# Altium schematic sheet Schematic_Thu.SchDoc
size A
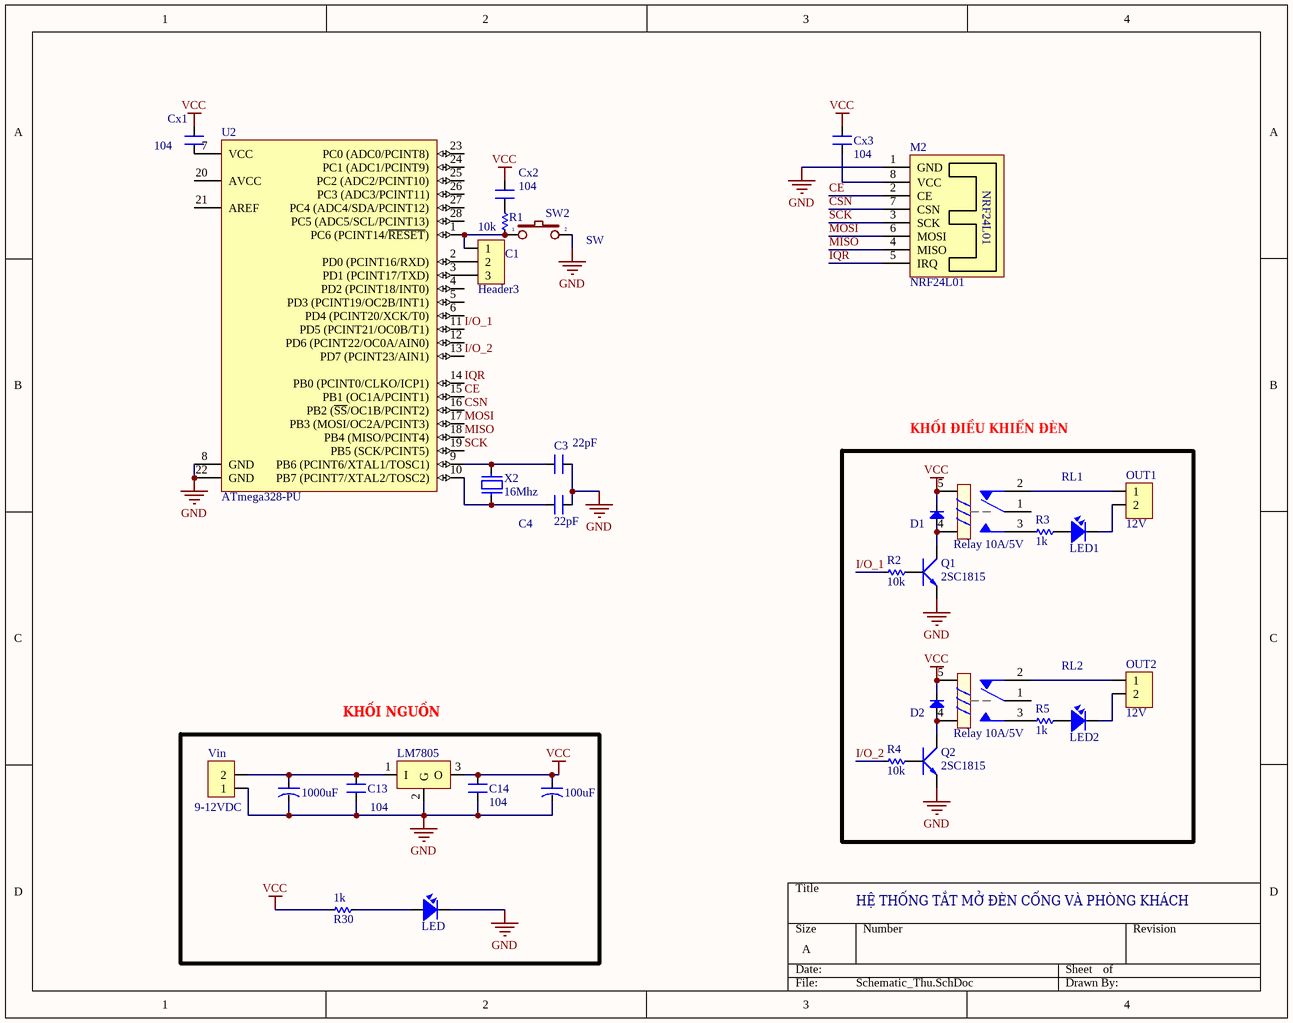
[diagram p0: Schematic_Thu.SchDoc]

## Parts
1k  R30  [RES-1/2W]
100uF  CN-ALU-DIP  [CA-ALU-2.54]  (value not drawn)
1000uF  CN-ALU-DIP  [CA-ALU-2.54]  (value not drawn)
C1  Header3  [HDR3]
C3  22pF  [CN1.5]
C4  22pF  [CN1.5]
C13  104  [CN1.5]
C14  104  [CN1.5]
Cx1  104  [CN-SMD-0805]
Cx2  104  [CN-SMD-0805]
Cx3  104  [CN-SMD-0805]
D1  Diode  [DIO-1A]  (value not drawn)
D2  Diode  [DIO-1A]  (value not drawn)
LED  LED  [LED-3MM-RED]  (value not drawn)
LED1  LED  [LED 3512]  (value not drawn)
LED2  LED  [LED 3512]  (value not drawn)
LM7805  LM78xx  [TO220-123]  (value not drawn)
M2  NRF24L01  [NRF24L01]
OUT1  12V  [Header2]
OUT2  12V  [Header2]
Q1  2SC1815  [TO92-123]
Q2  2SC1815  [TO92-123]
R1  10k  [RES-1/2W]
R2  10k  [RES-1/2W]
R3  1k  [RES-1/2W]
R4  10k  [RES-1/2W]
R5  1k  [RES-1/2W]
RL1  Relay 10A/5V  [RELAY 5]
RL2  Relay 10A/5V  [RELAY 5]
SW2  SW  [SW1-DIP]
U2  ATmega328-PU  [DIP28]
Vin  9-12VDC  [Header2]
X2  16Mhz  [XT2]

## Blocks framed on the sheet
KHỐI ĐIỀU KHIỂN ĐÈN: D1 D2 LED1 LED2 OUT1 OUT2 Q1 Q2 R2-R5 RL1 RL2
KHỐI NGUỒN: 1k 100uF 1000uF C13 C14 LED LM7805 Vin

## Nets
GND: 100uF.2 1000uF.2 C3.2 C4.2 C13.2 C14.1 LED.2 LM7805.2(G) M2.1(GND) Q1.1(E) Q2.1(E) SW2.2 U2.8(GND) U2.22(GND) Vin.1
VCC: 1k.2 100uF.1 C14.2 Cx1.2 Cx2.2 Cx3.2 D1.2(K) D2.2(K) LM7805.3(O) RL1.5 RL2.5
CE: M2.2(CE) U2.15(PB1_(OC1A/PCINT1))
CSN: M2.7(CSN) U2.16(PB2_(~{SS}/OC1B/PCINT2))
I/O_1: R2.2 U2.11(PD5_(PCINT21/OC0B/T1))
I/O_2: R4.2 U2.13(PD7_(PCINT23/AIN1))
IQR: M2.5(IRQ) U2.14(PB0_(PCINT0/CLKO/ICP1))
MISO: M2.4(MISO) U2.18(PB4_(MISO/PCINT4))
MOSI: M2.6(MOSI) U2.17(PB3_(MOSI/OC2A/PCINT3))
SCK: M2.3(SCK) U2.19(PB5_(SCK/PCINT5))
Net1k_1: 1k.1 LED.1
Net1000uF_1: 1000uF.1 C13.1 LM7805.1(I) Vin.2
NetC1_1: C1.1 R1.1 SW2.1 U2.1(PC6_(PCINT14/~{RESET}))
NetC1_2: C1.2 U2.2(PD0_(PCINT16/RXD))
NetC1_3: C1.3 U2.3(PD1_(PCINT17/TXD))
NetC3_1: C3.1 U2.9(PB6_(PCINT6/XTAL1/TOSC1)) X2.2
NetC4_1: C4.1 U2.10(PB7_(PCINT7/XTAL2/TOSC2)) X2.1
NetCx1_1: Cx1.1 U2.7(VCC)
NetCx2_1: Cx2.1 R1.2
NetCx3_1: Cx3.1 M2.8(VCC)
NetD1_1: D1.1(A) Q1.2(C) RL1.4
NetD2_1: D2.1(A) Q2.2(C) RL2.4
NetLED1_1: LED1.1 R3.2
NetLED1_2: LED1.2 OUT1.2
NetLED2_1: LED2.1 R5.2
NetLED2_2: LED2.2 OUT2.2
NetOUT1_1: OUT1.1 RL1.2
NetOUT2_1: OUT2.1 RL2.2
NetQ1_3: Q1.3(B) R2.1
NetQ2_3: Q2.3(B) R4.1
NetR3_1: R3.1 RL1.3
NetR5_1: R5.1 RL2.3

Not connected (* = marked no-connect by the designer): RL1 1; RL2 1; U2 4(PD2_(PCINT18/INT0)) 5(PD3_(PCINT19/OC2B/INT1)) 6(PD4_(PCINT20/XCK/T0)) 12(PD6_(PCINT22/OC0A/AIN0)) 20(AVCC) 21(AREF) 23(PC0_(ADC0/PCINT8)) 24(PC1_(ADC1/PCINT9)) 25(PC2_(ADC2/PCINT10)) 26(PC3_(ADC3/PCINT11)) 27(PC4_(ADC4/SDA/PCINT12)) 28(PC5_(ADC5/SCL/PCINT13))

## Notes on the sheet
- HỆ THỐNG TẮT MỞ ĐÈN CỔNG VÀ PHÒNG KHÁCH

## Library data of the parts
1k R1-R5 = Res: Manufacturer: Generic Components; Class: Passive; SubClass: R; Published: 08/06/2000; Publisher: Altium Hobart Technology Centre
100uF 1000uF = CN-ALU-DIP: Capacitor (Semiconductor SIM Model); Value: 104; LatestRevisionDate: 17-Jul-2002; LatestRevisionNote: Re-released for DXP Platform.; PackageReference: C1206; Publisher: Altium Limited
C1 = Header3: Header IDC, 3 x 1 Pin Vertical 2.54mm Pitch (Non-Boxed, Male); Manufacturer: W¨¹rth Elektronik eiSos GmbH; partNo: 613002143121; ComponentLink1 Description: Manufacturer; ComponentLink2 Description: Datasheet; NoPins: 02; Created Date: 29 March 2013; ComponentLink1URL: http://www.we-online.com; ComponentLink2URL: http://katalog.we-online.de/em/datasheet/6130xx143121.pdf; Created by: Karrer Zheng
C3 C4 C13 C14 Cx1-Cx3 = CN: Value: 33pF
D1 D2 = Diode: Default Diode; Code - JEDEC: DO-214-AB; Value: 1N5007; Published: 8-Jun-2000; Revision: July-2002: Re-released for DXP Platform.; Publisher: Altium Limited
LED = LED: LED Single colour Green and Red; Value: LED 3 ly Single Colour
LED1 LED2 = LED SMD: Value: LED 3 - 5 ly 2 Colour
LM7805 = LM78xx: Positive Voltage Regulator; Note: Tab is connected to pin 3 (GND).; Published: 24-Aug-2001; LatestRevisionDate: 17-Jul-2002; LatestRevisionNote: Re-released for DXP Platform.; DatasheetVersion: Apr-1994; PackageVersion: Jul-1998; PackageReference: ISOWATT220AB; Publisher: Altium Limited; PackageDescription: TO, Thru-Hole, Vertical, Heatsink Mounted; 3 In-Line Leads; Pitch 2.54 mm; Pin sequence 1, 3, 2; ComponentLink1Description: Manufacturer Link; ComponentLink1URL: http://www.st.com/; ComponentLink2Description: Datasheet; ComponentLink2URL: http://www.st.com/stonline/products/literature/ds/2146/l78m05c.pdf
OUT1 OUT2 Vin = Header2: Header IDC, 2 x 1 Pin Vertical 2.54mm Pitch (Non-Boxed, Male); Manufacturer: W¨¹rth Elektronik eiSos GmbH; partNo: 613002143121; ComponentLink1 Description: Manufacturer; ComponentLink2 Description: Datasheet; NoPins: 02; Created Date: 29 March 2013; ComponentLink1URL: http://www.we-online.com; ComponentLink2URL: http://katalog.we-online.de/em/datasheet/6130xx143121.pdf; Created by: Karrer Zheng
Q1 Q2 = 2SC1815: NPN 600mW, ECB; Value: C1815
RL1 RL2 = Relay 5: Relay SPDT,10A - 12VDC 5 Pin; Value: Relay SPDT, 10A, 12V
SW2 = SW2: Switch button 2 pin; Value: SW chip 2 pin
U2 = ATmega328-PU: 8-bit AVR Microcontroller, 32KB Flash, 1KB EEPROM, 2KB SRAM, 28-pin PDIP, Industrial Grade (-40°C to 85°C); Published: 1-Apr-2010; DatasheetVersion: revA, Jan-2010; PackageVersion: revB, Sep-2001; PackageReference: 28P3; Publisher: Altium Limited; PackageDescription: 28-lead (0.300"/7.62mm Wide) Plastic Dual Inline Package (PDIP); Supplier 1: Digi-Key; Supplier Part Number 1: ATMEGA328-PU-ND; Supplier 2: Mouser; Supplier Part Number 2: 556-ATMEGA328-PU; ComponentLink1Description: Manufacturer Link; ComponentLink1URL: http://www.atmel.com/products/avr/default.asp?; ComponentLink2Description: ATmega48A/48PA/88A/88PA/168A/168PA/328/328P Datasheet; ComponentLink2URL: http://www.atmel.com/dyn/resources/prod_documents/8271.pdf; ComponentLink3Description: ATmega48A/48PA/88A/88PA/168A/168PA/328/328P Summary; ComponentLink3URL: http://www.atmel.com/dyn/resources/prod_documents/8271S.pdf; ComponentLink4Description: Atmel.com Home; ComponentLink4URL: http://www.atmel.com
X2 = XT2: Crystal, 32.768 KHz, -40 to 85 degC, 3.2 x 1.5 x 0.9 mm SMD; Value: 4Mhz